# EAGLE design AM Modulator (EAGLE 9.6.2)
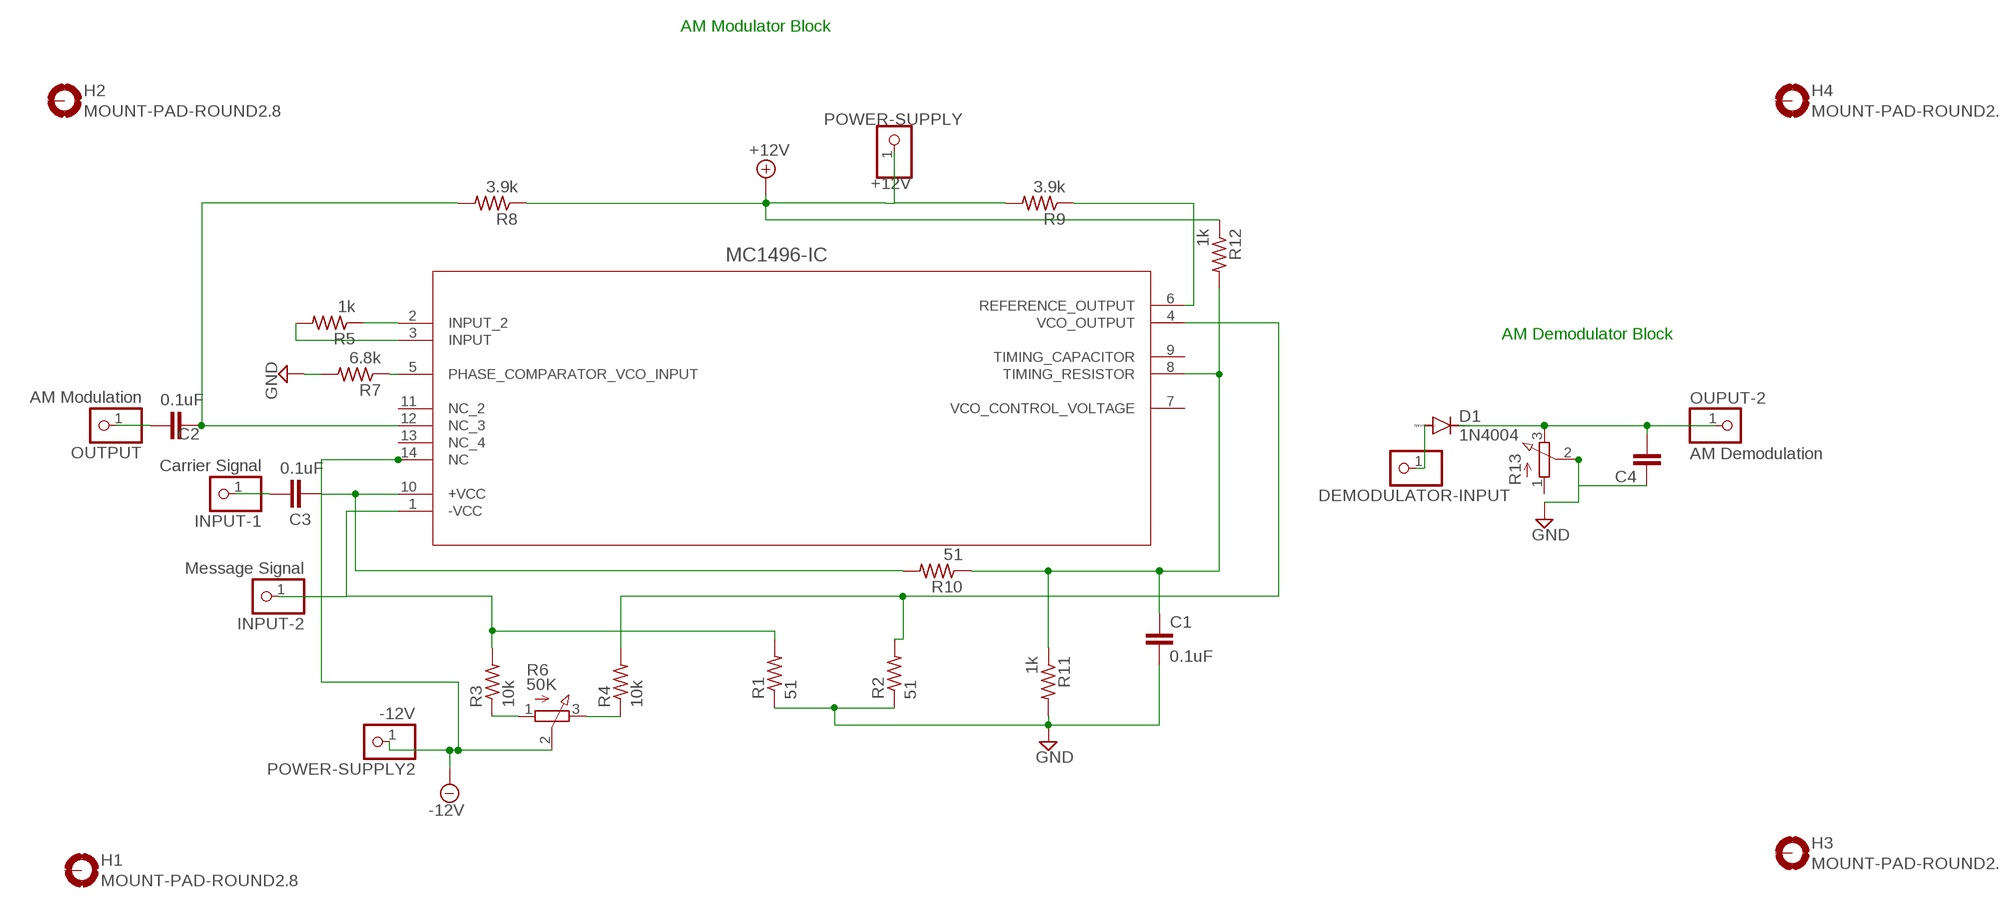
[diagram p0: schematic, sheet 1]

## Parts
C1  0.1uF  C-EU025-024X044  [C025-024X044]
C2  0.1uF  C-EU025-024X044  [C025-024X044]
C3  0.1uF  C-EU025-024X044  [C025-024X044]
C4  C-EU025-024X044  [C025-024X044]
D1  1N4004  [DO41-10]
DEMODULATOR-INPUT  PINHD-1X1  [1X01]
H1  MOUNT-PAD-ROUND2.8  [2,8-PAD]
H2  MOUNT-PAD-ROUND2.8  [2,8-PAD]
H3  MOUNT-PAD-ROUND2.8  [2,8-PAD]
H4  MOUNT-PAD-ROUND2.8  [2,8-PAD]
INPUT-1  Carrier Signal  PINHD-1X1  [1X01]
INPUT-2  Message Signal  PINHD-1X1  [1X01]
MC1496-IC  LM565CN  [DIP_565CN_TEX]
OUPUT-2  AM Demodulation  PINHD-1X1  [1X01]
OUTPUT  AM Modulation  PINHD-1X1  [1X01]
POWER-SUPPLY  +12V  PINHD-1X1  [1X01]
POWER-SUPPLY2  -12V  PINHD-1X1  [1X01]
R1  51  R-US_0207/10  [0207/10]
R2  51  R-US_0207/10  [0207/10]
R3  10k  R-US_0207/10  [0207/10]
R4  10k  R-US_0207/10  [0207/10]
R5  1k  R-US_0207/10  [0207/10]
R6  50K  3RP/1610N  [3RP/1610N]
R7  6.8k  R-US_0207/10  [0207/10]
R8  3.9k  R-US_0207/10  [0207/10]
R9  3.9k  R-US_0207/10  [0207/10]
R10  51  R-US_0207/10  [0207/10]
R11  1k  R-US_0207/10  [0207/10]
R12  1k  R-US_0207/10  [0207/10]
R13  3RP/1610N  [3RP/1610N]

## Nets
+12V: POWER-SUPPLY.1 R8.1 R9.2 R12.1
-12V: MC1496-IC.14(NC) POWER-SUPPLY2.1 R6.2(S)
GND: C1.2 C4.1 R1.1 R2.1 R7.2 R11.2 R13.2(S)
N$1: INPUT-2.1 MC1496-IC.1(-VCC) R1.2 R3.2
N$2: MC1496-IC.4(VCO_OUTPUT) R2.2 R4.2
N$3: R3.1 R6.1(A)
N$4: R4.1 R6.3(E)
N$5: C1.1 MC1496-IC.8(TIMING_RESISTOR) R10.1 R11.1 R12.2
N$6: MC1496-IC.5(PHASE_COMPARATOR_VCO_INPUT) R7.1
N$7: MC1496-IC.6(REFERENCE_OUTPUT) R9.1
N$8: C2.1 MC1496-IC.12(NC_3) R8.2
N$9: MC1496-IC.2(INPUT_2) R5.1
N$10: MC1496-IC.3(INPUT) R5.2
N$11: C3.2 MC1496-IC.10(+VCC) R10.2
N$12: C2.2 OUTPUT.1
N$13: C3.1 INPUT-1.1
N$14: C4.2 D1.C OUPUT-2.1 R13.3(E)
N$15: D1.A DEMODULATOR-INPUT.1
Unconnected: H1.B2,8(MOUNT) H2.B2,8(MOUNT) H3.B2,8(MOUNT) H4.B2,8(MOUNT) MC1496-IC.7(VCO_CONTROL_VOLTAGE) MC1496-IC.9(TIMING_CAPACITOR) MC1496-IC.11(NC_2) MC1496-IC.13(NC_4) R13.1(A)

## Notes on the sheet
- AM Modulator Block
- AM Demodulator Block

## Library data of the parts
C1-C4 = rcl:C-EU: CAPACITOR, European symbol; SPICEPREFIX: C
D1 = diode:1N4004: DIODE general purpose rectifier, 1 A
DEMODULATOR-INPUT INPUT-1 INPUT-2 OUPUT-2 OUTPUT POWER-SUPPLY POWER-SUPPLY2 = adafruit:PINHD-1X1: Pin header 1x1 for 0.1" spacing With round pins
H1-H4 = holes:MOUNT-PAD-ROUND: MOUNTING PAD, round
MC1496-IC = Duplicate_1496:LM565CN; COPYRIGHT: Copyright (C) 2024 Ultra Librarian. All rights reserved.; MANUFACTURER_PART_NUMBER: LM565CN; MFR_NAME: Texas Instruments
R1-R5 R7-R12 = rcl:R-US_: RESISTOR, American symbol; SPICEPREFIX: R
R6 R13 = pot:3RP/1610N: 16mm Potentiometer one level Source: http://www.alphapotentiometers.net/html/16mm_pot_2.html

## Board
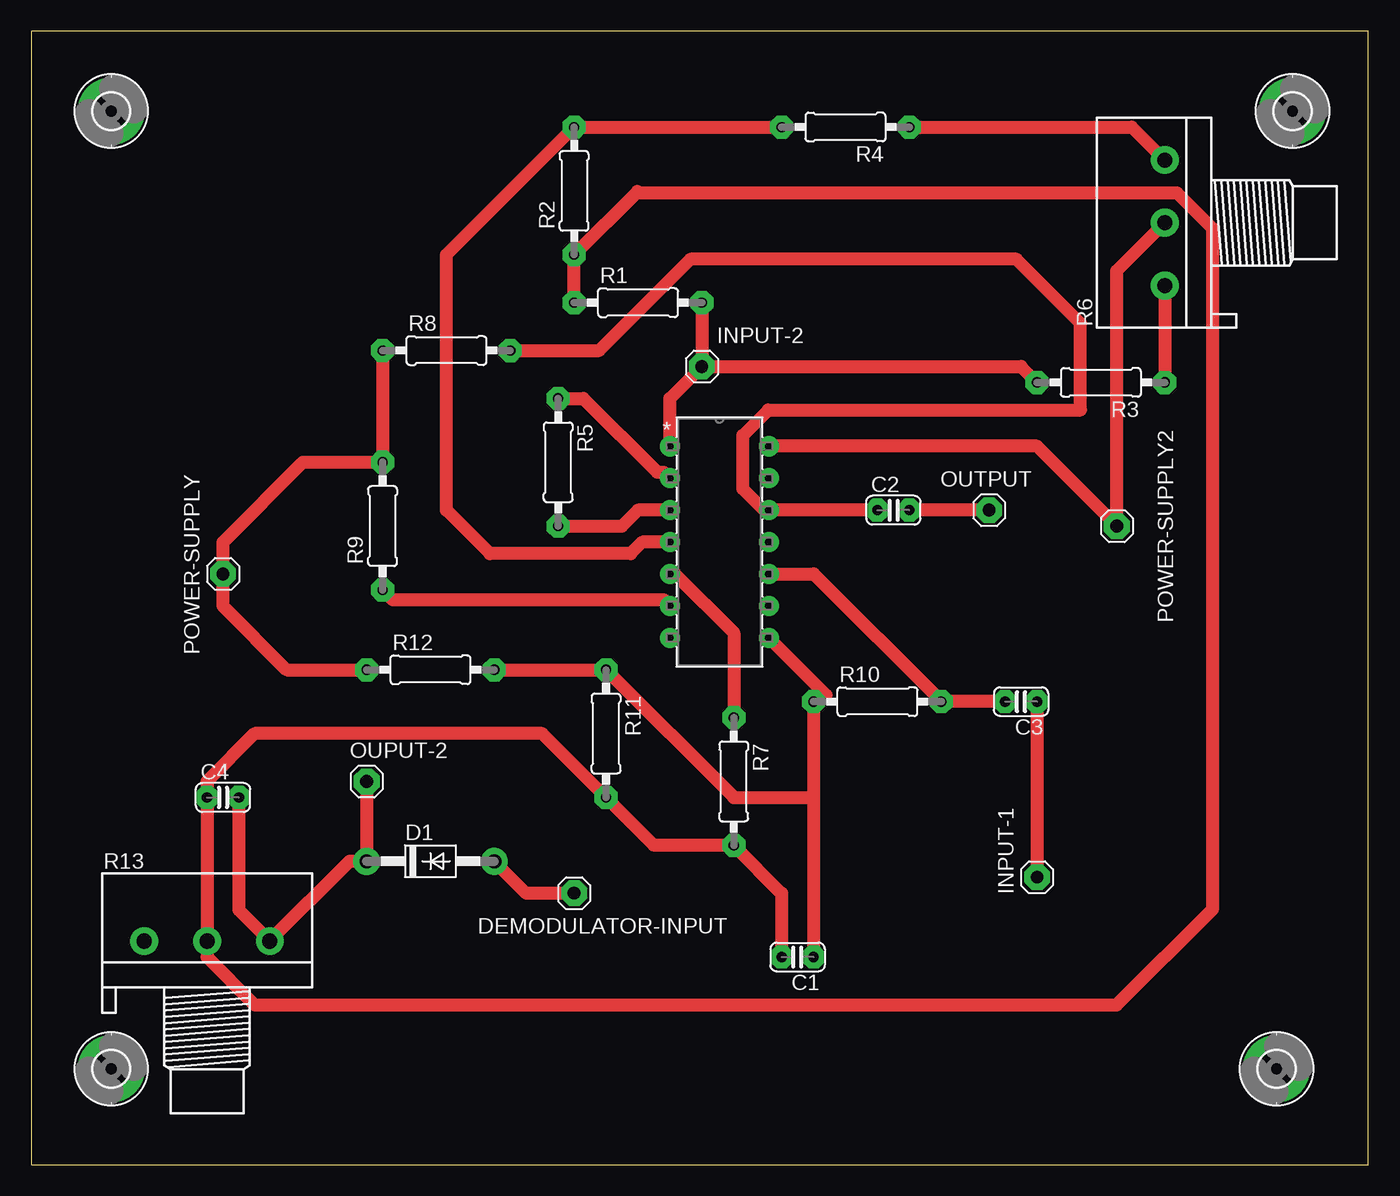
[diagram p1: board, top side]

Size 106.35 x 90.16 mm. Coordinates in mm from the lower left corner, seen from the top.
Outline: 0,0 106.35,0 106.35,90.16 0,90.16 0,0
Copper layers (1*16): Top 0.035mm / dielectric 1.5mm / Bottom 0.035mm
Design rules "default *": minimum track width 40mil, minimum drill 32mil, track to track 40mil, track to pad 30mil, pad to pad 6mil, via to via 6mil, smd to smd 6mil, copper to edge 40mil, drill to drill 6mil, minimum pad ring 80mil, minimum via ring 8mil, stop-mask expansion 4mil, vias tented up to drill 0mil, thermal gap 10mil

### Footprints (pad centres in the part's own frame; a part is rotated, then mirrored left to right if it is on the bottom)
C025-024X044 = drill 0.813 octagon: 1 -1.27,0; 2 1.27,0
DO41-10 = drill 1.118: A 5.08,0; C -5.08,0
1X01 = drill 1.016 pad 1.93 octagon: 1 0,0
2,8-PAD = drill 2.8 pad 5.334: B2,8 0,0
DIP_565CN_TEX = drill 0.584 pad 1.092: 1 0,0; 2 0,-2.54; 3 0,-5.08; 4 0,-7.62; 5 0,-10.16; 6 0,-12.7; 7 0,-15.24; 8 7.874,-15.24; 9 7.874,-12.7; 10 7.874,-10.16; 11 7.874,-7.62; 12 7.874,-5.08; 13 7.874,-2.54; 14 7.874,0
0207/10 = drill 0.813 octagon: 1 -5.08,0; 2 5.08,0
3RP/1610N = drill 1.2 pad 2.184: 1 -5,0; 2 0,0; 3 5,0

### Placement (x,y rotation side)
C1  60.96,16.51 180 top
C2  68.58,52.07 0 top
C3  78.74,36.83 180 top
C4  15.24,29.21 0 top
D1  31.75,24.13 0 top
DEMODULATOR-INPUT  43.18,21.59 0 top
H1  99.06,7.62 0 top
H2  6.35,83.82 0 top
H3  100.33,83.82 0 top
H4  6.35,7.62 0 top
INPUT-1  80.01,22.86 0 top
INPUT-2  53.34,63.5 0 top
MC1496-IC  50.8,57.15 0 top
OUPUT-2  26.67,30.48 0 top
OUTPUT  76.2,52.07 0 top
POWER-SUPPLY  15.24,46.99 0 top
POWER-SUPPLY2  86.36,50.8 0 top
R1  48.26,68.58 0 top
R2  43.18,77.47 90 top
R3  85.09,62.23 180 top
R4  64.77,82.55 180 top
R5  41.91,55.88 270 top
R6  90.17,74.93 90 top
R7  55.88,30.48 270 top
R8  33.02,64.77 0 top
R9  27.94,50.8 90 top
R10  67.31,36.83 0 top
R11  45.72,34.29 270 top
R12  31.75,39.37 0 top
R13  13.97,17.78 0 top

### Tracks (layer width: path | path; a pad name or v marks a point on that pad's centre or on a via)
+12V
  Top 1.016: R8.1 R9.2 21.59,55.88 15.24,49.53 POWER-SUPPLY.1 15.24,44.45 20.32,39.37 R12.1
-12V
  Top 1.016: R6.2 86.36,71.12 POWER-SUPPLY2.1 80.01,57.15 MC1496-IC.14
GND
  Top 1.016: R1.1 R2.1 48.21,77.42 48.42,77.31 91.16,77.31 93.98,74.48 93.98,20.32 86.36,12.7 17.78,12.7 13.97,16.51 R13.2 C4.1 13.97,30.48 17.78,34.29 40.64,34.29 R11.2 49.53,25.4 R7.2 59.69,21.59 C1.2
N$1
  Top 1.016: INPUT-2.1 78.74,63.5 R3.2 | MC1496-IC.1 50.8,60.96 INPUT-2.1 | R1.2 INPUT-2.1
N$2
  Top 1.016: R4.2 R2.2 33.02,72.39 33.02,52.07 36.47,48.62 47.68,48.62 48.59,49.53 MC1496-IC.4
N$3
  Top 1.016: R6.1 R3.1
N$4
  Top 1.016: R4.1 87.55,82.55 R6.3
N$5
  Top 1.016: MC1496-IC.8 63.23,37.35 R10.1 62.23,29.21 | 62.23,29.21 C1.1 | R12.2 R11.1 55.88,29.21 62.23,29.21
N$6
  Top 1.016: MC1496-IC.5 50.84,46.95 51.23,46.95 55.88,42.3 R7.1
N$7
  Top 1.016: MC1496-IC.6 50.33,44.92 28.74,44.92 R9.1
N$8
  Top 1.016: C2.1 MC1496-IC.12 58.29,52.07 56.6,53.75 56.6,58.01 58.64,60.05 83.46,60.05 83.46,66.95 78.38,72.03 52.44,72.03 45.17,64.77 R8.2
N$9
  Top 1.016: MC1496-IC.2 50.33,55.08 49.78,55.08 43.9,60.96 R5.1
N$10
  Top 1.016: R5.2 46.99,50.8 48.26,52.07 MC1496-IC.3
N$11
  Top 1.016: MC1496-IC.10 62.23,46.99 R10.2 C3.2
N$12
  Top 1.016: OUTPUT.1 C2.2
N$13
  Top 1.016: C3.1 INPUT-1.1
N$14
  Top 1.016: OUPUT-2.1 D1.C 25.32,24.13 R13.3 16.51,20.24 C4.2
N$15
  Top 1.016: DEMODULATOR-INPUT.1 39.37,21.59 D1.A